# EAGLE design HackBoard (EAGLE 7.1.0)
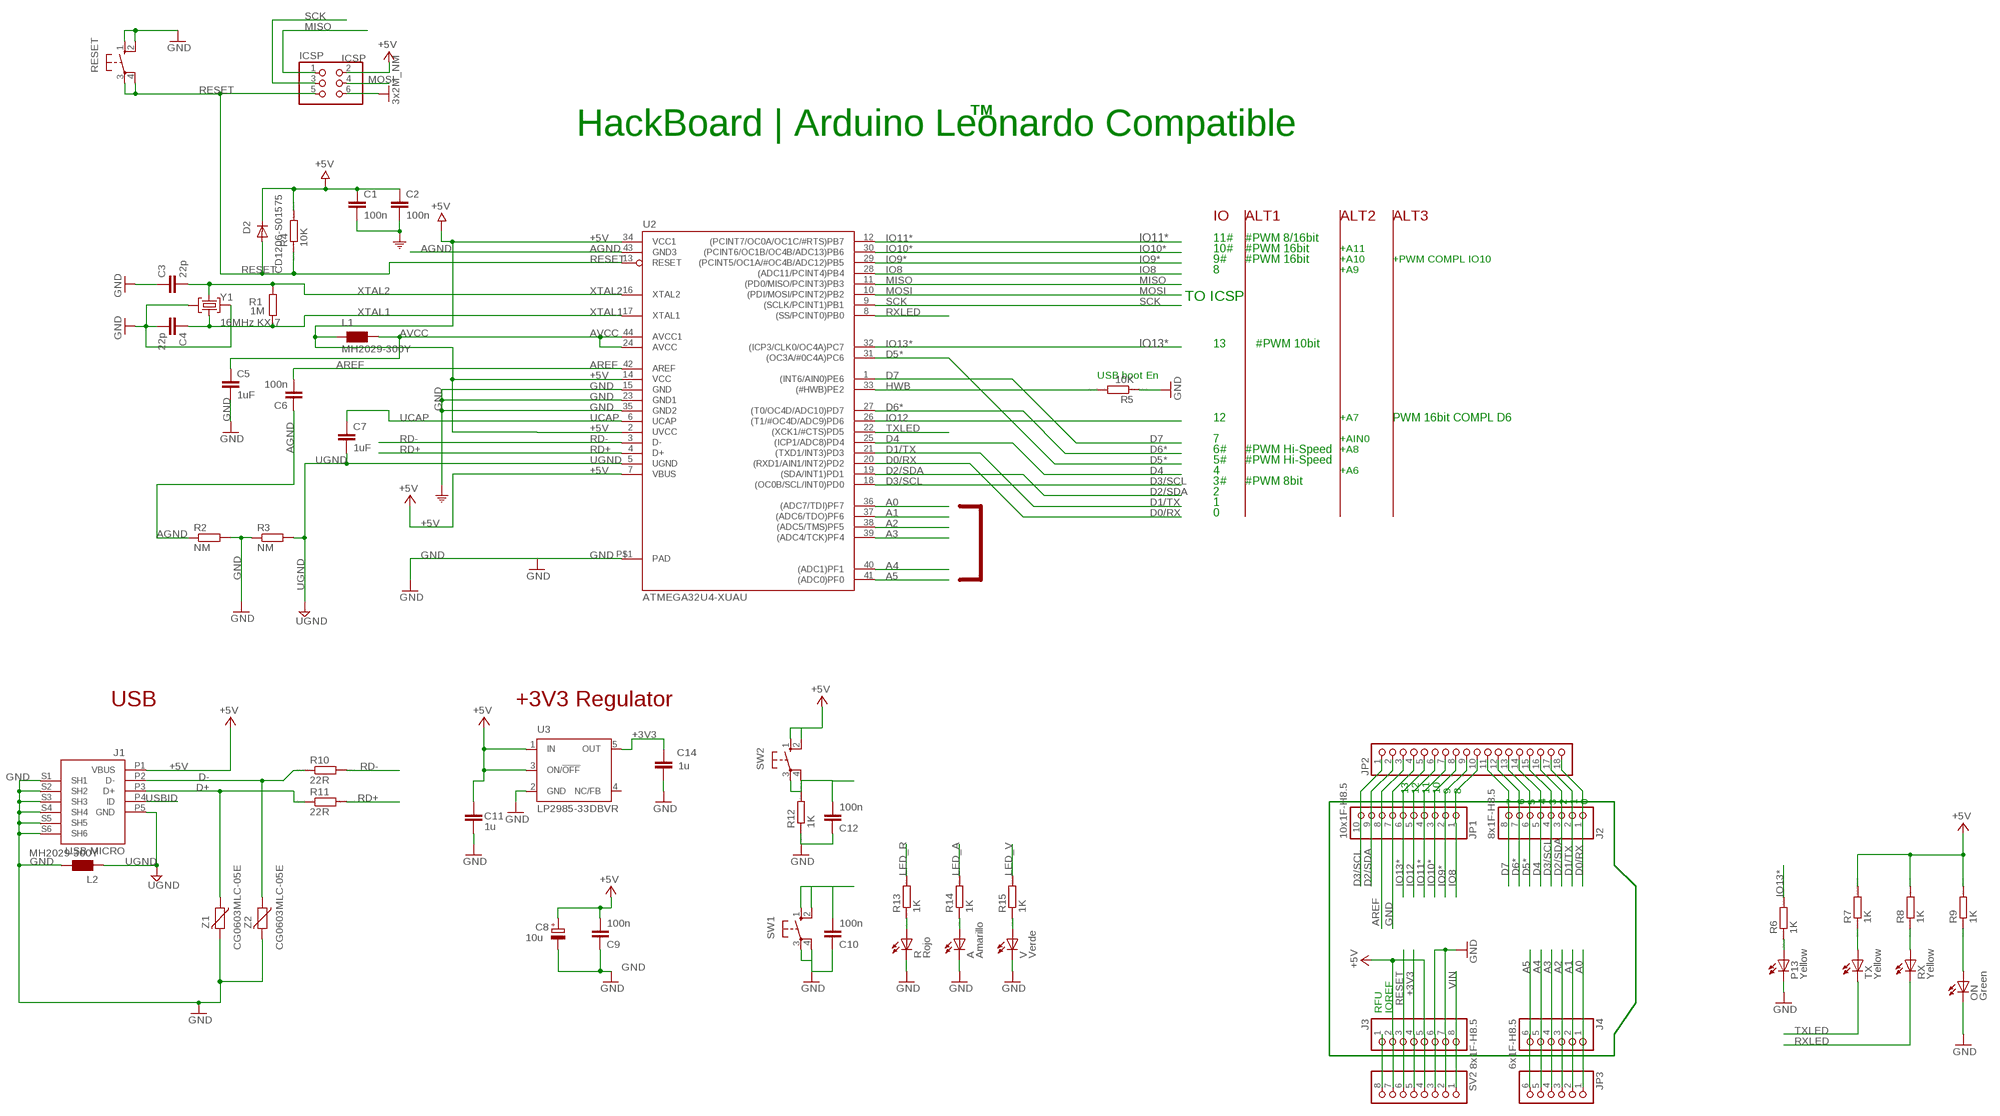
[diagram p0: schematic, sheet 1]

## Parts
A  Amarillo  LEDCHIPLED_0805  [CHIPLED_0805]
C1  100n  C-EUC0805  [C0805]
C2  100n  C-EUC0805  [C0805]
C3  22p  C-EUC0603  [C0603-ROUND]
C4  22p  C-EUC0603  [C0603-ROUND]
C5  1uF  C-EUC0603  [C0603-ROUND]
C6  100n  C-EUC0805  [C0805]
C7  1uF  C-EUC0603  [C0603-ROUND]
C8  10u  CPOL-EUSMCB  [SMC_B]
C9  100n  C-EUC0805  [C0805]
C10  100n  C-EUC0805  [C0805]
C11  1u  C-EUC0603  [C0603-ROUND]
C12  100n  C-EUC0805  [C0805]
C14  1u  C-EUC0603  [C0603-ROUND]
D2  CD1206-S01575  DIODE-MINIMELF  [MINIMELF]
ICSP  ICSP  PINHD-2X3  [2X03]
J1  USB MICRO  MYCON2_USB-MINI-B  [CON2_USB_MICRO_B_AT]
J2  8x1F-H8.5  PINHD-1X8  [1X08]
J3  8x1F-H8.5  PINHD-1X8  [1X08]
J4  6x1F-H8.5  PINHD-1X6  [1X06]
JP1  10x1F-H8.5  PINHD-1X10  [1X10]
JP2  PINHD-1X18  [1X18]
JP3  PINHD-1X6  [1X06]
L1  MH2029-300Y  WE-CBF_0805  [0805]
L2  MH2029-300Y  WE-CBF_0805  [0805]
ON  Green  LEDCHIPLED_0805  [CHIPLED_0805]
P13  Yellow  LEDCHIPLED_0805  [CHIPLED_0805]
R  Rojo  LEDCHIPLED_0805  [CHIPLED_0805]
R1  1M  R-EU_R0603  [R0603-ROUND]
R2  NM  R-EU_R0402  [R0402]
R3  NM  R-EU_R0402  [R0402]
R4  10K  R  [R0805]
R5  10K  R  [R0805]
R6  1K  R-EU_M0805  [M0805]
R7  1K  R-EU_M0805  [M0805]
R8  1K  R-EU_M0805  [M0805]
R9  1K  R-EU_M0805  [M0805]
R10  22R  R-EU_M0805  [M0805]
R11  22R  R-EU_M0805  [M0805]
R12  1K  R-EU_M0805  [M0805]
R13  1K  R-EU_M0805  [M0805]
R14  1K  R-EU_M0805  [M0805]
R15  1K  R-EU_M0805  [M0805]
RESET  10-XX  [B3F-10XX]
RX  Yellow  LEDCHIPLED_0805  [CHIPLED_0805]
SV2  PINHD-1X8  [1X08]
SW1  10-XX  [B3F-10XX]
SW2  10-XX  [B3F-10XX]
TX  Yellow  LEDCHIPLED_0805  [CHIPLED_0805]
U2  ATMEGA32U4-XUAU  [TQFP44-PAD]
U3  LP2985-33DBVR  LP2985-XXDBVR33  [SOT23-DBV]
V  Verde  LEDCHIPLED_0805  [CHIPLED_0805]
Y1  16MHz KX-7  CRYSTAL-3.2-2.5  [CRYSTAL-3.2-2.5]
Z1  CG0603MLC-05E  VARISTORCN0603  [CT/CN0603]
Z2  CG0603MLC-05E  VARISTORCN0603  [CT/CN0603]

## Nets
+3V3: C14.2 J3.4 SV2.5 U3.5(OUT)
+5V [usbvcc]: C1.1 C2.1 C8.+ C9.2 C11.2 D2.C ICSP.2 J1.P1(VBUS) J3.2 J3.5 L1.1 R4.2 R7.2 R8.2 R9.2 SV2.4 SV2.7 SW2.1(S) SW2.2(S1) U2.2(UVCC) U2.7(VBUS) U2.14(VCC) U2.34(VCC1) U3.1(IN) U3.3(ON/!OFF)
A0: J4.1 JP3.1 U2.36((ADC7/TDI)PF7)
A1: J4.2 JP3.2 U2.37((ADC6/TDO)PF6)
A2: J4.3 JP3.3 U2.38((ADC5/TMS)PF5)
A3: J4.4 JP3.4 U2.39((ADC4/TCK)PF4)
A4: J4.5 JP3.5 U2.40((ADC1)PF1)
A5: J4.6 JP3.6 U2.41((ADC0)PF0)
AGND: C6.1 R2.1 U2.43(GND3)
AREF [aref]: C6.2 JP1.8 JP2.3 U2.42(AREF)
AVCC: C5.1 L1.2 U2.24(AVCC) U2.44(AVCC1)
D0/RX: J2.1 JP2.18 U2.20((RXD1/AIN1/INT2)PD2)
D1/TX: J2.2 JP2.17 U2.21((TXD1/INT3)PD3)
D2/SDA: J2.3 JP1.9 JP2.2 JP2.16 U2.19((SDA/INT1)PD1)
D3/SCL: J2.4 JP1.10 JP2.1 JP2.15 U2.18((OC0B/SCL/INT0)PD0)
D4: J2.5 JP2.14 U2.25((ICP1/ADC8)PD4)
D5*: J2.6 JP2.13 U2.31((OC3A/#0C4A)PC6)
D6*: J2.7 JP2.12 U2.27((T0/OC4D/ADC10)PD7)
D7: J2.8 JP2.11 U2.1((INT6/AIN0)PE6)
D+: J1.P3(D+) R11.1 Z1.1
D-: J1.P2(D-) R10.1 Z2.1
GND [gnd]: A.C C1.2 C2.2 C3.1 C4.2 C5.2 C8.- C9.1 C10.1 C11.1 C12.1 C14.1 ICSP.6 J1.S1(SH1) J1.S2(SH2) J1.S3(SH3) J1.S4(SH4) J1.S5(SH5) J1.S6(SH6) J3.6 J3.7 JP1.7 JP2.4 L2.2 ON.C P13.C R2.2 R3.1 R5.1 R12.1 R.C RESET.1(S) RESET.2(S1) SV2.2 SV2.3 SW1.3(P) SW1.4(P1) U2.15(GND) U2.23(GND1) U2.35(GND2) U2.P$1(PAD) U3.2(GND) V.C Y1.2(GND) Y1.4(GND) Z1.2 Z2.2 ; supply symbol labelled 3x2M_NM, COM
HWB: R5.2 U2.33((#HWB)PE2)
IO8: JP1.1 JP2.10 U2.28((ADC11/PCINT4)PB4)
IO9*: JP1.2 JP2.9 U2.29((PCINT5/OC1A/#OC4B/ADC12)PB5)
IO10*: JP1.3 JP2.8 U2.30((PCINT6/OC1B/OC4B/ADC13)PB6)
IO11*: JP1.4 JP2.7 U2.12((PCINT7/OC0A/OC1C/#RTS)PB7)
IO12: JP1.5 JP2.6 U2.26((T1/#OC4D/ADC9)PD6)
IO13*: JP1.6 JP2.5 R6.2 U2.32((ICP3/CLK0/OC4A)PC7)
LED_A: R14.2
LED_R: R13.2
LED_V: R15.2
MISO: ICSP.1 U2.11((PD0/MISO/PCINT3)PB3)
MOSI: ICSP.4 U2.10((PDI/MOSI/PCINT2)PB2)
N$1: R7.1 TX.A
N$2: P13.A R6.1
N$3: ON.A R9.1
N$4: R8.1 RX.A
N$6: J3.1 SV2.8
N$8: R13.1 R.A
N$9: A.A R14.1
N$10: R15.1 V.A
RD+: R11.2 U2.4(D+)
RD-: R10.2 U2.3(D-)
RESET: D2.A ICSP.5 J3.3 R4.1 RESET.3(P) RESET.4(P1) SV2.6 U2.13(RESET)
RXLED: RX.C U2.8((SS/PCINT0)PB0)
SCK: ICSP.3 U2.9((SCLK/PCINT1)PB1)
SW1: C10.2 SW1.1(S) SW1.2(S1)
SW2: C12.2 R12.2 SW2.3(P) SW2.4(P1)
TXLED: TX.C U2.22((XCK1/#CTS)PD5)
UCAP: C7.1 U2.6(UCAP)
UGND [gnd]: C7.2 J1.P5(GND) L2.1 R3.2 U2.5(UGND)
USBID: J1.P4(ID)
VIN [power]: J3.8 SV2.1
XTAL1: C4.1 R1.1 U2.17(XTAL1) Y1.1(C1)
XTAL2: C3.2 R1.2 U2.16(XTAL2) Y1.3(C2)
Unconnected: U3.4(NC/FB)

## Notes on the sheet
- TM
- HackBoard | Arduino Leonardo Compatible
- IO | ALT1 | ALT2 | ALT3
- 11# | #PWM 8/16bit
- 10# | #PWM 16bit | +A11
- 9# | #PWM 16bit | +A10 | +PWM COMPL IO10
- 8 | +A9
- TO ICSP
- 13 | #PWM 10bit
- USB boot En
- 12 | +A7 | PWM 16bit COMPL D6
- 7 | +AIN0
- 6# | #PWM Hi-Speed | +A8
- 5# | #PWM Hi-Speed
- 4 | +A6
- 3# | #PWM 8bit
- 2
- 1
- 0
- USB | +3V3 Regulator
- 13 | 12 | 11 | 10 | 9 | 8
- 7 | 6 | 5 | 4 | 3 | 2 | 1 | 0
- RFU | IOREF

## Library data of the parts
A ON P13 R RX TX V = led:LED: LED OSRAM: - CHIPLED LG R971, LG N971, LY N971, LG Q971, LY Q971, LO R971, LY R971 LH N974, LH R974 LS Q976, LO Q976, LY Q976 LO Q996 - Hyper CHIPLED LW Q18S LB Q993, LB Q99A, LB R99A - SideLED LS A670, LO A670, LY A670, LG A670, LP A670 LB A673, LV A673, LT A673, LW A673 LH A674 LY A675 LS A676, LA A676, LO A676, LY A676, LW A676 LS A679, LY A679, LG A679 - Hyper Micro SIDELED® LS Y876, LA Y876, LO Y876, LY Y876 LT Y87S - SmartLED LW L88C, LW L88S LB L89C, LB L89S, LG L890 LS L89K, LO L89K, LY L89K LS L896, LA L896, LO L896, LY L896 - TOPLED LS T670, LO T670, LY T670, LG T670, LP T670 LSG T670, LSP T670, LSY T670, LOP T670, LYG T670 LG T671, LOG T671, LSG T671 LB T673, LV T673, LT T673, LW T673 LH T674 LS T676, LA T676, LO T676, LY T676, LB T676, LH T676, LSB T676, LW T676 LB T67C, LV T67C, LT T67C, LS T67K, LO T67K, LY T67K, LW E67C LS E67B, LA E67B, LO E67B, LY E67B, LB E67C, LV E67C, LT E67C LW T67C LS T679, LY T679, LG T679 LS T770, LO T770, LY T770, LG T770, LP T770 LB T773, LV T773, LT T773, LW T773 LH T774 LS E675, LA E675, LY E675, LS T675 LS T776, LA T776, LO T776, LY T776, LB T776 LHGB T686 LT T68C, LB T68C - Hyper Mini TOPLED® LB M676 - Mini TOPLED Santana® LG M470 LS M47K, LO M47K, LY M47K Source: http://www.osram.convergy.de LUXEON: - LUMILED® LXK2-PW12-R00, LXK2-PW12-S00, LXK2-PW14-U00, LXK2-PW14-V00 LXK2-PM12-R00, LXK2-PM12-S00, LXK2-PM14-U00 LXK2-PE12-Q00, LXK2-PE12-R00, LXK2-PE12-S00, LXK2-PE14-T00, LXK2-PE14-U00 LXK2-PB12-K00, LXK2-PB12-L00, LXK2-PB12-M00, LXK2-PB14-N00, LXK2-PB14-P00, LXK2-PB14-Q00 LXK2-PR12-L00, LXK2-PR12-M00, LXK2-PR14-Q00, LXK2-PR14-R00 LXK2-PD12-Q00, LXK2-PD12-R00, LXK2-PD12-S00 LXK2-PH12-R00, LXK2-PH12-S00 LXK2-PL12-P00, LXK2-PL12-Q00, LXK2-PL12-R00 Source: www.luxeon.com KINGBRIGHT: KA-3528ASYC Source: www.kingbright.com
C1 C2 C6 C9 C10 C12 = rcl:C-EU: CAPACITOR, European symbol
C3-C5 C7 C11 C14 = SmartPrj:C-EU: CAPACITOR, European symbol
C8 = rcl:CPOL-EU: POLARIZED CAPACITOR, European symbol
D2 = diode:DIODE-: DIODE
ICSP = SmartPrj:PINHD-2X3: PIN HEADER
J1 = SmartPrj:MYCON2_USB-MINI-B
J2 J3 = SmartPrj:PINHD-1X8: PIN HEADER
J4 = SmartPrj:PINHD-1X6: PIN HEADER
JP1 = SmartPrj:PINHD-1X10: PIN HEADER
JP2 = pinhead:PINHD-1X18: PIN HEADER
JP3 = pinhead:PINHD-1X6: PIN HEADER
L1 L2 = wuerth-elektronik:WE-CBF: SMD EMI Suppression Ferrite Beads - excellent anti-EMI properties - low DCR - impedances till 3000 ohms - rated current up to 6 A
R1-R3 = SmartPrj:R-EU_: RESISTOR, European symbol
R4 R5 = eagle-ltspice:R: RESISTOR, European symbol; SPICEMODEL: NONE; SPICEPREFIX: R
R6-R15 = resistor:R-EU_: RESISTOR, European symbol; SPICEPREFIX: R
RESET SW1 SW2 = switch-omron:10-XX: OMRON SWITCH; MPN: B3F-1000; OC_FARNELL: 176432; OC_NEWARK: 36M3542
SV2 = pinhead:PINHD-1X8: PIN HEADER
U2 = SmartPrj:ATMEGA32U4-XU
U3 = SmartPrj:LP2985-XXDBVR: ULTRALOW-POWER 50-mA LOW-DROPOUT LINEAR REGULATORS 50-mA Low-Dropout Regulator Source: http://focus.ti.com/lit/ds/symlink/tps77001.pdf
Y1 = SmartPrj:CRYSTAL-3.2-2.5
Z1 Z2 = varistor:VARISTOR: VARISTOR

## Net classes
0 default: width 0.254 mm, drill 0.61 mm, clearance 0.254 mm
1 power: width 0.254 mm, drill 0.61 mm, clearance 0.254 mm
2 gnd: width 0.254 mm, drill 0.61 mm, clearance 0.254 mm
3 usbvcc: width 0.254 mm, drill 0.61 mm, clearance 0.254 mm
4 aref: width 0.254 mm, drill 0.61 mm, clearance 0.254 mm

## Board
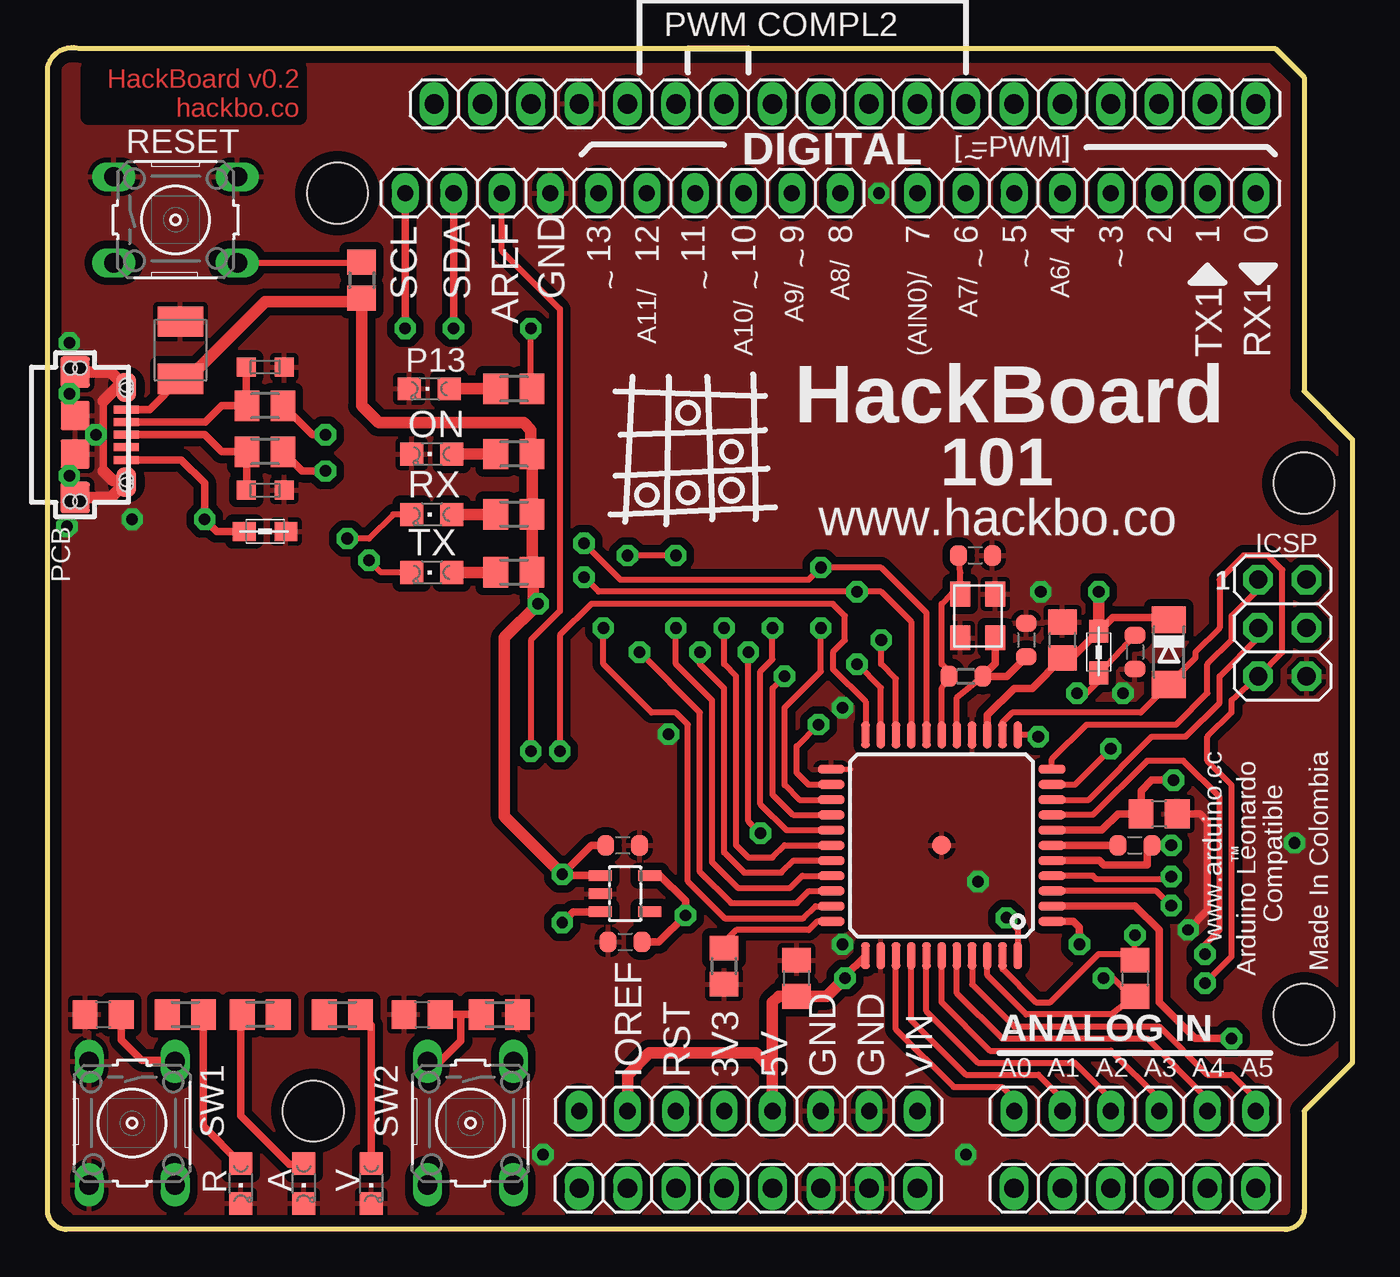
[diagram p1: board, top side]
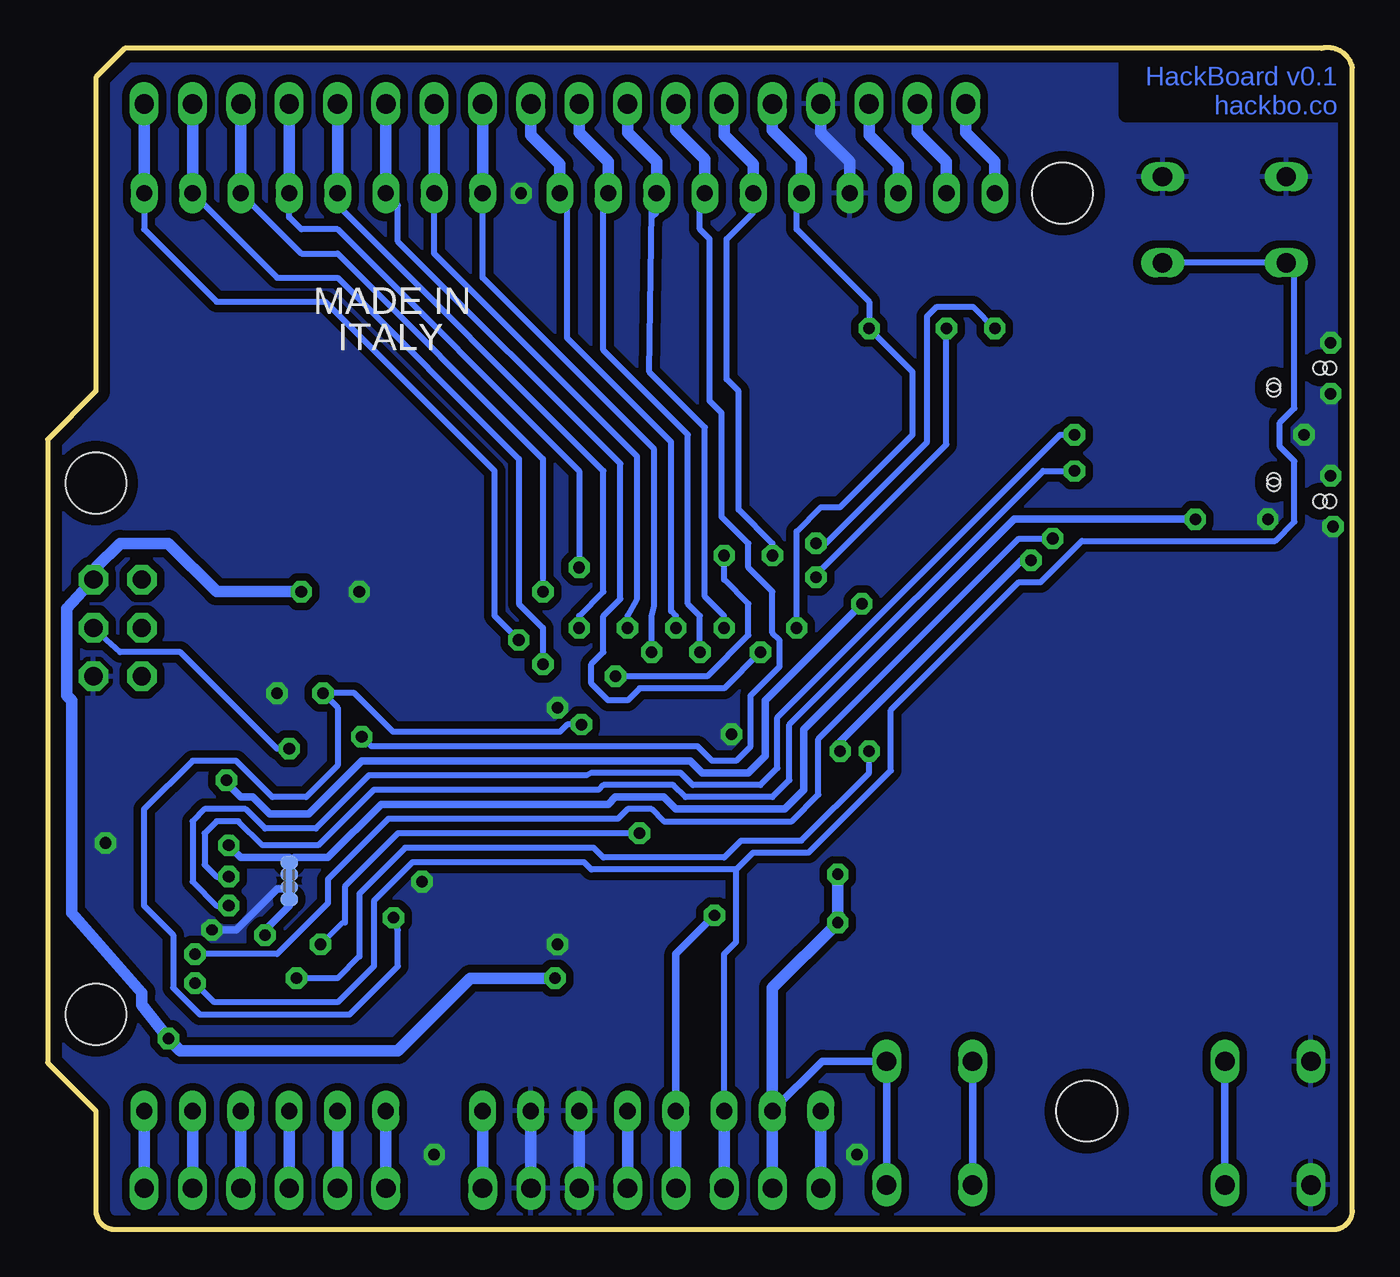
[diagram p2: board, bottom side, seen from below]

Size 68.58 x 62.14 mm. Coordinates in mm from the lower left corner, seen from the top.
Outline: 64.52,62.1 66.04,60.58 66.04,44.07 68.58,41.53 68.58,8.76 66.04,6.22 66.04,1 arc-90 65.04,0 1,0 arc-90 0,1 0,61.1 arc-90 1.64,62.1 64.52,62.1
Copper layers (1*16): Top 0.035mm / dielectric 1.5mm / Bottom 0.035mm
Design rules "default": minimum track width 10mil, minimum drill 22mil, track to track 10mil, track to pad 10mil, pad to pad 8mil, via to via 12mil, smd to smd 8mil, copper to edge 24mil, drill to drill 12mil, minimum pad ring 10mil, minimum via ring 10mil, stop-mask expansion 2mil, vias tented up to drill 30mil, thermal gap 10mil
Holes 3.2 mm at 66.04,39.24 66.04,11.3 15.24,54.48 13.97,6.22
vRestrict: area 42.5,42.3 to 43.1,42.5; area 35.8,38.9 to 36.4,39.4; area 44.5,38.9 to 45.2,39.4; area 41.3,38.9 to 41.8,39.4; area 47.9,14 to 48.5,14.5; area 50.4,13.8 to 50.9,14.7

### Footprints (pad centres in the part's own frame; a part is rotated, then mirrored left to right if it is on the bottom)
CHIPLED_0805 = smd 1.2 x 1.2: A 0,-1.05; C 0,1.05
C0805 = smd 1.3 x 1.5: 1 -0.95,0; 2 0.95,0
C0603-ROUND = smd 0.898 x 1.1: 1 -0.889,0; 2 0.889,0
SMC_B = smd 1.6 x 2.4: + -1.5,0; - 1.5,0
MINIMELF = smd 1.4 x 1.8: A 1.7,0; C -1.7,0
2X03 = drill 0.95 pad 1.55 octagon: 1 -2.54,-1.27; 2 -2.54,1.27; 3 0,-1.27; 4 0,1.27; 5 2.54,-1.27; 6 2.54,1.27
CON2_USB_MICRO_B_AT = smd 0.406 x 1.346: P1 -1.321,2.692; P2 -0.66,2.692; P3 0,2.692; P4 0.66,2.692; P5 1.321,2.692 | smd 1.651 x 1.549: S1 -3.302,0; S2 3.302,0 | smd 1.524 x 1.016: S3 -2.489,2.692; S4 2.489,2.692 | smd 1.524 x 1.524: S5 -1.016,0; S6 1.016,0 | hole 0.7: -3.505,0.254; -3.505,-0.254; 3.505,0.254; 3.505,-0.254; -2.616,2.692; -2.362,2.692; 2.362,2.692; 2.616,2.692
1X08 = drill 0.85 pad 1.422 long: 1 -8.89,0; 2 -6.35,0; 3 -3.81,0; 4 -1.27,0; 5 1.27,0; 6 3.81,0; 7 6.35,0; 8 8.89,0
1X06 = drill 0.85 pad 1.422 long: 1 -6.35,0; 2 -3.81,0; 3 -1.27,0; 4 1.27,0; 5 3.81,0; 6 6.35,0
1X10 = drill 0.85 pad 1.422 long: 1 -11.43,0; 2 -8.89,0; 3 -6.35,0; 4 -3.81,0; 5 -1.27,0; 6 1.27,0; 7 3.81,0; 8 6.35,0; 9 8.89,0; 10 11.43,0
1X18 = drill 1.016 long: 1 -21.59,0; 2 -19.05,0; 3 -16.51,0; 4 -13.97,0; 5 -11.43,0; 6 -8.89,0; 7 -6.35,0; 8 -3.81,0; 9 -1.27,0; 10 1.27,0; 11 3.81,0; 12 6.35,0; 13 8.89,0; 14 11.43,0; 15 13.97,0; 16 16.51,0; 17 19.05,0; 18 21.59,0
1X06' = drill 1.016 long: 1 -6.35,0; 2 -3.81,0; 3 -1.27,0; 4 1.27,0; 5 3.81,0; 6 6.35,0
0805 = smd 1.2 x 1: 1 -1.1,0; 2 1.1,0
R0603-ROUND = smd 0.898 x 1.1: 1 -0.889,0; 2 0.889,0
R0402 = smd 0.7 x 0.9: 1 -0.65,0; 2 0.65,0
R0805 = smd 1.3 x 1.5: 1 -0.95,0; 2 0.95,0
M0805 = smd 1.3 x 1.6: 1 -0.95,0; 2 0.95,0
B3F-10XX = drill 1.016 long: 1 -3.251,2.261; 2 3.251,2.261; 3 -3.251,-2.261; 4 3.251,-2.261
1X08' = drill 1.016 long: 1 -8.89,0; 2 -6.35,0; 3 -3.81,0; 4 -1.27,0; 5 1.27,0; 6 3.81,0; 7 6.35,0; 8 8.89,0
TQFP44-PAD = smd 1.4 x 0.45: 1 -5.8,4; 2 -5.8,3.2; 3 -5.8,2.4; 4 -5.8,1.6; 5 -5.8,0.8; 6 -5.8,0; 7 -5.8,-0.8; 8 -5.8,-1.6; 9 -5.8,-2.4; 10 -5.8,-3.2; 11 -5.8,-4; 23 5.8,-4; 24 5.8,-3.2; 25 5.8,-2.4; 26 5.8,-1.6; 27 5.8,-0.8; 28 5.8,0; 29 5.8,0.8; 30 5.8,1.6; 31 5.8,2.4; 32 5.8,3.2; 33 5.8,4 | smd 0.45 x 1.4: 12 -4,-5.8; 13 -3.2,-5.8; 14 -2.4,-5.8; 15 -1.6,-5.8; 16 -0.8,-5.8; 17 0,-5.8; 18 0.8,-5.8; 19 1.6,-5.8; 20 2.4,-5.8; 21 3.2,-5.8; 22 4,-5.8; 34 4,5.8; 35 3.2,5.8; 36 2.4,5.8; 37 1.6,5.8; 38 0.8,5.8; 39 0,5.8; 40 -0.8,5.8; 41 -1.6,5.8; 42 -2.4,5.8; 43 -3.2,5.8; 44 -4,5.8 | smd 1 x 1: P$1 0,0
SOT23-DBV = smd 0.55 x 1.2: 1 -0.95,-1.3; 2 0,-1.3; 3 0.95,-1.3; 4 0.95,1.3; 5 -0.95,1.3
CRYSTAL-3.2-2.5 = smd 1.3 x 1.05: 1 -1.15,-0.925; 2 1.15,-0.925; 3 1.15,0.925; 4 -1.15,0.925
CT/CN0603 = smd 1 x 1: 1 -1,0; 2 1,0

### Placement (x,y rotation side)
A  13.46,2.41 180 top
C1  39.37,13.21 90 top
C2  53.34,30.99 90 top
C3  51.44,30.99 270 top
C4  48.77,35.43 0 top
C5  57.15,30.35 270 top
C6  57.15,13.21 270 top
C7  57.15,20.19 0 top
C8  6.99,46.23 90 top
C9  58.42,21.84 180 top
C10  2.92,11.3 0 top
C11  30.23,20.19 180 top
C12  19.68,11.3 0 top
C14  30.35,15.11 0 top
D2  58.93,30.35 270 top
ICSP  64.9,31.62 270 top
J1  1.45,41.78 270 top
J2  54.61,54.48 180 top
J3  36.83,6.22 0 top
J4  57.15,6.22 0 top
JP1  30.23,54.48 180 top
JP2  41.91,59.18 0 top
JP3  [1X06']  57.15,2.16 0 top
L1  55.24,30.35 270 top
L2  11.43,36.7 0 top
ON  20.19,40.77 90 top
P13  20.07,44.2 90 top
R  10.16,2.41 180 top
R1  48.26,29.08 0 top
R2  55.88,18.01 90 bottom
R3  55.88,18.64 90 bottom
R4  16.51,49.91 270 top
R5  35.56,13.84 90 top
R6  24.51,44.2 0 top
R7  24.51,34.54 0 top
R8  24.51,37.59 0 top
R9  24.51,40.77 0 top
R10  11.43,43.31 0 top
R11  11.43,40.89 0 top
R12  23.75,11.3 180 top
R13  7.24,11.3 180 top
R14  11.18,11.3 0 top
R15  15.49,11.3 180 top
RESET  6.73,53.09 0 top
RX  20.19,37.59 90 top
SV2  [1X08']  36.83,2.16 180 top
SW1  4.45,5.59 270 top
SW2  22.23,5.59 270 top
TX  20.19,34.54 90 top
U2  46.99,20.19 180 top
U3  30.35,17.65 270 top
V  17.02,2.41 180 top
Y1  48.9,32.26 270 top
Z1  11.43,38.86 0 top
Z2  11.43,45.34 0 top

### Tracks (layer width: path | path; a pad name or v marks a point on that pad's centre or on a via)
+3V3  (via drill 0.6)
  Top 0.406: U3.5 31.72,18.67 32.13,18.67 33.53,17.27 v33.53,16.51 32.13,15.11 C14.2
  Bottom 0.406: J3.4 35.56,14.48 v33.53,16.51
  Bottom 0.61: J3.4 SV2.5
+5V  (via drill 0.6, 0.61)
  Top 0.305: 52.77,17.02 U2.2
  Top 0.406: U2.14 49.39,27.04 50.8,28.45 51.75,28.45 C2.1 | 53.49,29.7 C2.1 | v62.23,10.03 60.33,10.03 58.42,11.94 58.42,15.75 57.15,17.02 52.77,17.02 | 42.99,14.29 U2.34 41.91,13.31 v41.91,13.21 | D2.C 58.8,32.13 58.75,32.18 55.97,32.18 L1.1 53.83,30.04 C2.1 | U2.7 55.41,20.99 56.26,21.84 C9.2 57.47,23.05 58.04,23.62 v59.18,23.62 | J1.P1 5.36,43.1 C8.+ | U3.3 27.62,16.7 v27.05,16.13 | 27.12,18.6 U3.1 | C11.2 28.57,20.19 v27.05,18.67
  Top 0.61: v55.24,33.53 L1.1 | v41.91,13.21 40.96,12.26 C1.1 38.42,12.26 38.1,11.94 38.1,8.38 | C8.+ 7.39,44.73 11.43,48.77 16.32,48.77 R4.2 16.51,43.31 17.4,42.42 25.02,42.42 25.4,42.04 25.4,40.83 R9.2 R8.2 R7.2 25.46,34.1 25.53,34.04 25.53,33.15 v25.78,32.89 24,31.11 24,21.72 v27.05,18.67 27.12,18.6 | J3.2 30.48,8.13 31.62,9.27 37.21,9.27 38.1,8.38 | 38.1,8.38 J3.5
  Bottom 0.406: v59.18,23.62 59.18,23.5 58.42,22.73 57.78,22.73 56.9,21.84 54.86,21.84 52.07,24.64 34.8,24.64 34.16,24 31.75,24 30.86,24.89 30.86,27.81 v25.78,32.89 | SW2.2 SW2.1 27.86,8.84 J3.2
  Bottom 0.61: v55.24,33.53 59.69,33.53 62.23,36.07 64.77,36.07 66.04,34.8 ICSP.2 67.56,32.64 67.56,28.07 67.31,27.81 67.31,16.64 63.63,12.45 63.63,11.81 v62.23,10.03 61.59,9.4 50.16,9.4 46.35,13.21 v41.91,13.21 | v27.05,18.67 v27.05,16.13 30.48,12.7 J3.2 SV2.7 | SV2.4 J3.5
A0
  Top 0.305: U2.36 44.59,10.53 47.62,7.49 50.16,7.49 50.8,6.86 J4.1
  Bottom 0.61: JP3.1 J4.1
A1
  Top 0.305: U2.37 45.39,11 48.26,8.13 52.07,8.13 53.34,6.86 J4.2
  Bottom 0.61: JP3.2 J4.2
A2
  Top 0.305: U2.38 46.19,11.47 48.9,8.76 53.98,8.76 55.88,6.86 J4.3
  Bottom 0.61: JP3.3 J4.3
A3
  Top 0.305: U2.39 46.99,11.94 49.53,9.4 55.88,9.4 58.42,6.86 J4.4
  Bottom 0.61: JP3.4 J4.4
A4
  Top 0.305: U2.40 47.79,12.41 50.16,10.03 57.78,10.03 60.96,6.86 J4.5
  Bottom 0.61: JP3.5 J4.5
A5
  Top 0.305: U2.41 48.59,12.88 50.8,10.67 58.42,10.67 60.96,8.13 62.23,8.13 63.5,6.86 J4.6
  Bottom 0.61: JP3.6 J4.6
AGND  (via drill 0.61)
  Top 0.305: U2.43 50.19,13.69 51.94,11.94 52.7,11.94 55.24,14.48 56.52,14.48 57.13,13.84 C6.1 v57.15,15.47
  Bottom 0.406: v57.15,15.47 57.15,15.75 55.88,17.02 R2.1
AREF  (via drill 0.61)
  Top 0.305: U2.42 49.39,13.35 51.44,11.3 55.9,11.3 C6.2 56.96,12.26 56.01,13.21 v55.5,13.21 | v25.4,25.15 25.4,30.99 26.92,32.51 26.92,48.39 23.88,51.44 JP1.8
  Bottom 0.305: v55.5,13.21 53.34,13.21 52.2,14.35 52.2,17.65 49.78,20.07 39.88,20.07 39.37,19.56 33.02,19.56 32.13,20.45 28.96,20.45 25.4,24 v25.4,25.15
  Bottom 0.61: JP1.8 23.88,56.01 25.4,57.53 JP2.3
AVCC  (via drill 0.61)
  Top 0.305: U2.44 50.99,15.79 v50.39,16.38 | U2.24 39.98,23.39 39.37,24 39.37,25.4 v40.51,26.54 | v54.1,28.19 54.61,28.19 55.24,28.83 L1.2 55.7,29.7 C5.1
  Bottom 0.305: v50.39,16.38 50.16,15.75 50.16,13.84 52.7,11.3 60.58,11.3 61.98,12.7 61.98,15.49 63.5,17.02 63.5,22.1 60.96,24.64 58.67,24.64 56.77,22.73 54.99,22.73 53.34,24.38 53.34,27.43 v54.1,28.19 52.45,28.19 50.42,26.16 41.66,26.16 41.27,26.54 v40.51,26.54
D0/RX  (via drill 0.61)
  Top 0.305: U2.20 44.59,28.94 43.81,29.72 v43.81,30.99
  Bottom 0.305: v43.81,30.99 45.09,32.26 45.09,39.88 53.98,48.77 59.69,48.77 63.5,52.58 J2.1
  Bottom 0.61: JP2.18 J2.1
D1/TX  (via drill 0.61)
  Top 0.305: U2.21 43.79,28.47 v42.55,29.72
  Bottom 0.305: J2.2 56.52,50.04 53.34,50.04 43.81,40.51 43.81,32.89 42.55,31.62 v42.55,29.72
  Bottom 0.61: J2.2 JP2.17
D2/SDA  (via drill 0.61)
  Top 0.305: U2.19 45.39,31.95 43.81,33.53 v42.55,33.53 28.96,33.53 v28.19,34.29
  Top 0.406: v21.34,47.37 JP1.9
  Bottom 0.305: J2.3 55.24,51.31 53.34,51.31 42.55,40.51 v42.55,33.53 | v28.19,34.29 28.19,34.42 21.34,41.27 v21.34,47.37
  Bottom 0.61: J2.3 JP2.16 | JP1.9 21.34,56.13 22.86,57.66 JP2.2
D3/SCL  (via drill 0.61)
  Top 0.305: v28.19,36.07 30.1,34.16 40.01,34.16 v40.64,34.8 43.81,34.8 46.19,32.42 U2.18
  Top 0.406: v18.8,47.37 JP1.10
  Bottom 0.305: J2.4 55.88,53.21 55.24,52.58 53.34,52.58 40.64,39.88 v40.64,34.8 | v28.19,36.07 27.69,36.07 22.35,41.4 22.35,48.01 21.84,48.51 19.94,48.51 v18.8,47.37
  Bottom 0.61: J2.4 JP2.15 | JP1.10 18.8,56.13 20.32,57.66 JP2.1
D4  (via drill 0.61)
  Top 0.305: U2.25 39.51,22.59 38.73,23.37 38.73,27.43 40.64,29.34 v40.64,31.62
  Bottom 0.305: J2.5 53.34,53.85 39.37,39.88 39.37,33.53 40.64,32.26 v40.64,31.62
  Bottom 0.61: J2.5 JP2.14
D5*  (via drill 0.61)
  Top 0.305: U2.31 40.02,17.79 39.38,17.16 35.93,17.16 34.29,18.8 34.29,27.18 v31.11,30.35
  Bottom 0.305: J2.6 50.16,53.85 50.16,51.94 38.48,40.26 38.48,33.15 39.37,32.26 39.37,30.35 40.01,29.72 40.01,28.7 39.12,27.81 38.1,27.81 37.47,28.45 33.02,28.45 v31.11,30.35
  Bottom 0.61: J2.6 JP2.13
D6*  (via drill 0.61)
  Top 0.305: U2.27 38.82,20.99 37.47,22.35 37.47,29.34 38.1,29.97 v38.1,31.62
  Bottom 0.305: J2.7 48.26,51.31 37.59,40.64 37.59,33.15 38.1,32.26 v38.1,31.62
  Bottom 0.61: J2.7 JP2.12
D7  (via drill 0.61)
  Top 0.305: v37.47,20.83 36.83,21.46 v36.83,30.35
  Top 0.406: U2.1 53.91,16.19 54.23,15.88 v54.23,14.99
  Bottom 0.254: 52.96,16.13 53.09,16.13 v54.23,14.99
  Bottom 0.305: J2.8 45.72,50.04 36.7,41.02 36.7,32.77 36.83,32.26 v36.83,30.35 | v37.47,20.83 50.16,20.83 52.96,18.03 52.96,16.13
  Bottom 0.61: J2.8 JP2.11
D+
  Top 0.406: J1.P3 8.26,41.78 9.14,40.89 R11.1 10.48,38.66 Z1.1
D-
  Top 0.406: J1.P2 8.28,42.44 9.14,43.31 R10.1 10.43,43.74 Z2.1
GND  (via drill 0.6, 0.61, 0.61 pad 1.02)
  Top 0.254: 42.22,24.19 U2.23
  Top 0.305: J1.S4 4.06,39.37
  Top 0.406: 2.92,39.88 2.92,43.56 | v59.94,15.75 60.96,16.76 60.96,21.46 60.58,21.84 C9.1
  Top 0.61: J1.S1 3.33,45.09 J1.S3 3.63,44.27 2.92,43.56 | J1.S2 3.33,38.48 J1.S4 | 2.92,39.88 3.43,39.37 4.06,39.37
  Bottom 0.406: R2.2 R3.1 55.97,17.91 56.52,17.91 58.67,15.75 v59.94,15.75
  Bottom 0.61: JP1.7 26.42,56.13 27.94,57.66 JP2.4 | SV2.3 J3.6 | SV2.2 J3.7
  other vias: 41.78,14.99 48.9,18.29 41.78,27.43 56.52,28.19 65.53,20.32 48.26,3.94 43.69,54.48 32.64,26.04 4.45,37.34 26.04,3.94 1.14,43.94 1.14,39.62 2.54,41.78 1.14,46.61 1.02,36.96 52.2,33.53
  pour Bottom (isolate 0.406, rank 2): 0.64,61.47 69.22,61.47 69.22,0.64 1.64,0.64 arc-90 0.64,5.32
  pour Top (isolate 0.406, rank 2): 0.64,61.47 71.25,61.47 71.12,5.32 arc-90 70.12,0.64 1.64,0.64 arc-90 0.64,5.32
HWB
  Top 0.305: U2.33 40.45,16.19 40.01,15.75 36.2,15.75 35.56,15.11 R5.2
IO8  (via drill 0.61)
  Top 0.305: U2.28 38.73,20.19 38.1,19.56 36.83,19.56 36.2,20.19 36.2,29.08 35.56,29.72 v35.56,31.62
  Bottom 0.305: v35.56,31.62 35.56,32.26 35.81,32.51 35.81,41.4 41.27,46.86 41.27,54.1 JP1.1
  Bottom 0.61: JP1.1 41.66,56.01 43.18,57.53 JP2.10
IO9*  (via drill 0.61)
  Top 0.305: U2.29 39.2,19.39 38.57,18.76 36.61,18.76 35.56,19.81 35.56,28.45 34.29,29.72 v34.29,30.35
  Bottom 0.305: v34.29,30.35 34.29,32.26 34.92,32.89 34.92,41.78 39.37,46.23 39.37,54.23 JP1.2
  Bottom 0.61: JP1.2 39.12,56.13 40.64,57.66 JP2.9
IO10*  (via drill 0.61)
  Top 0.305: U2.30 39.67,18.59 39.04,17.96 36.27,17.96 34.92,19.3 34.92,27.81 33.02,29.72 v33.02,31.62
  Bottom 0.305: 36.58,53.85 36.58,53.47 36.83,53.21 | 36.58,53.85 JP1.3 | v33.02,31.62 33.02,32.26 34.04,33.27 34.04,42.16 36.96,45.09 36.83,53.59 36.58,53.85
  Bottom 0.61: JP1.3 36.58,56.13 38.1,57.66 JP2.8
IO11*  (via drill 0.61)
  Top 0.305: U2.12 52.16,25.99 v52.07,25.91
  Bottom 0.305: v52.07,25.91 51.56,25.4 34.42,25.4 33.66,24.64 32.38,24.64 31.62,25.4 31.62,28.07 30.1,29.59 30.1,30.99 30.48,31.37 30.48,33.53 31.75,34.8 31.75,36.07 33.15,37.47 33.15,42.93 33.78,43.56 33.78,52.07 34.29,52.58 34.29,54.23 JP1.4
  Bottom 0.61: JP1.4 34.04,56.26 35.56,57.78 JP2.7
IO12  (via drill 0.61)
  Top 0.305: U2.26 39.17,21.79 38.1,22.86 38.1,28.45 v38.73,29.08 | v33.02,35.43 v30.48,35.43
  Bottom 0.305: v38.73,29.08 33.91,29.08 31.75,31.24 31.75,32.89 33.02,34.16 v33.02,35.43 | JP1.5 31.5,53.47 32.89,52.07 32.89,44.7 32.26,44.07 32.26,37.85 30.48,36.07 v30.48,35.43
  Bottom 0.61: JP1.5 31.5,56.01 33.02,57.53 JP2.6
IO13*  (via drill 0.6, 0.61)
  Top 0.305: U2.32 40.36,16.99 39.73,16.36 35.59,16.36 33.66,18.29 33.66,26.54 33.02,27.18 31.75,27.18 29.21,29.72 v29.21,31.62 | R6.2 25.4,44.26 v25.4,47.37
  Bottom 0.305: JP1.6 29.21,54.23 29.21,52.58 25.4,48.77 v25.4,47.37 23.11,45.09 23.11,41.78 26.92,37.97 27.94,37.97 29.21,36.7 v29.21,31.62
  Bottom 0.61: JP1.6 28.96,56.26 30.48,57.78 JP2.5
MISO
  Top 0.305: U2.11 52.79,24.72 54.61,26.54 59.31,26.54 60.96,28.19 60.96,29.72 62.23,30.99 62.23,32.26 63.63,33.66 ICSP.1
MOSI  (via drill 0.61)
  Top 0.305: U2.10 54,23.39 v55.88,25.27
  Bottom 0.305: v55.88,25.27 56.52,25.27 61.59,30.35 64.77,30.35 ICSP.4
N$1
  Top 0.61: R7.1 TX.A
N$2
  Top 0.61: P13.A R6.1
N$3
  Top 0.61: R9.1 ON.A
N$4
  Top 0.61: R8.1 RX.A
N$6
  Bottom 0.61: J3.1 SV2.8
N$8
  Top 0.406: R13.1 8.19,5.43 R.A
N$9
  Top 0.406: A.A 13.37,3.43 12.7,3.43 10.16,5.97 10.16,11.24 R14.1 10.41,11.24
N$10
  Top 0.406: R15.1 17.02,10.73 V.A
RD+  (via drill 0.61)
  Top 0.305: 58.98,18.47 v59.05,18.54 58.93,18.41 55.12,18.41 54.94,18.59 U2.4
  Top 0.406: R11.2 13.4,39.88 v14.61,39.88
  Bottom 0.305: v14.61,39.88 16.26,39.88 29.59,26.54 29.59,23.62 30.48,22.73 35.05,22.73 35.69,23.37 39.37,23.37 39.62,23.11 51.44,23.11 54.36,20.19 57.28,20.19 58.55,21.46 59.69,21.46 60.33,20.83 60.33,19.18 59.69,18.54 v59.05,18.54
RD-  (via drill 0.61)
  Top 0.305: v59.05,17.02 58.28,17.79 U2.3
  Top 0.406: R10.2 13.9,41.78 v14.61,41.78
  Bottom 0.305: v14.61,41.78 15.37,41.78 30.23,26.92 30.23,24.26 31.11,23.37 34.67,23.37 35.31,24 40.01,24 40.26,23.88 51.69,23.88 54.48,21.08 57.15,21.08 58.17,22.1 60.33,22.1 60.96,21.46 60.96,18.29 59.69,17.02 v59.05,17.02
RESET  (via drill 0.61)
  Top 0.305: v60.83,12.95 62.23,14.35 62.23,23.37 60.96,24.64 60.96,25.91 62.23,27.18 62.23,27.81 ICSP.5 64.9,30.35 64.9,34.67 64.14,35.43 62.87,35.43 61.59,34.16 61.59,31.62 60.33,30.35 60.33,30.05 D2.A 57.45,27.18 50.7,27.18 50.19,26.67 U2.13 | RESET.4 16.47,50.83 R4.1
  Bottom 0.305: 32.38,18.92 31.5,19.81 28.57,19.81 24.26,24.13 24.26,27.3 17.53,34.04 16.38,34.04 14.22,36.2 4.06,36.2 3.05,37.21 3.05,40.39 3.81,41.15 3.81,42.42 3.05,43.18 3.05,50.39 RESET.3 RESET.4 | 32.38,18.92 40.01,18.92 40.39,19.3 49.4,19.3 51.44,17.27 51.44,13.84 53.34,11.94 59.82,11.94 v60.83,12.95 | J3.3 33.02,14.48 32.38,15.11 32.38,18.92
  Bottom 0.61: J3.3 SV2.6
RXLED  (via drill 0.61)
  Top 0.305: U2.8 54.94,21.79 57.78,24.64 59.69,24.64 61.59,22.73 61.59,15.75 60.83,14.99 v60.83,14.48 | v15.75,36.32 16.89,36.32 18.16,37.59 RX.C
  Bottom 0.305: v60.83,14.48 56.52,14.48 53.85,17.14 53.85,18.41 50.67,21.59 38.61,21.59 38.1,22.1 36.83,22.1 36.2,21.46 29.46,21.46 28.07,22.86 28.07,25.78 17.53,36.32 v15.75,36.32
SCK
  Top 0.305: U2.9 54.72,22.59 58.04,25.91 59.82,25.91 61.59,27.69 61.59,29.08 63.63,31.11 ICSP.3
SW1
  Top 0.406: C10.2 3.87,9.97 4.95,8.89 6.66,8.89 SW1.1
  Bottom 0.406: SW1.1 SW1.2
SW2
  Top 0.406: SW2.3 20.65,8.84 21.72,9.91 21.72,11.3 | 21.72,11.3 C12.2 | R12.2 21.72,11.3
  Bottom 0.406: SW2.4 SW2.3
TXLED  (via drill 0.61)
  Top 0.305: U2.22 42.99,27.75 41.27,29.46 41.27,30.35 41.91,30.99 41.91,32.26 41.27,32.89 28.57,32.89 26.92,31.24 v26.92,25.15 | TX.C 17.53,34.54 v16.89,35.18
  Bottom 0.305: 17.4,35.18 v16.89,35.18
  Bottom 0.406: 17.4,35.18 26.92,25.65 v26.92,25.15
UCAP
  Top 0.406: U2.6 C7.1
UGND  (via drill 0.61)
  Top 0.406: v59.05,20.19 C7.2 57.78,20.18 57.78,19.18 55.5,19.18 55.28,19.39 U2.5 | J1.P5 7.04,40.46 8.26,39.24 v8.26,37.34 8.89,36.7 L2.1
  Bottom 0.406: v59.05,20.19 58.42,19.56 55.88,19.56 R3.2 55.62,19.56 53.85,19.56 51.05,22.35 39.12,22.35 38.73,22.73 36.2,22.73 35.56,22.1 29.84,22.1 28.83,23.11 28.83,26.29 17.78,37.34 v8.26,37.34
VIN
  Bottom 0.61: J3.8 SV2.1
XTAL1
  Top 0.305: U2.17 46.99,28.43 R1.1 47.62,29.08 46.99,29.72 46.99,32.89 47.51,33.41 Y1.1 47.97,34.52 C4.1
XTAL2
  Top 0.305: U2.16 47.79,27.96 R1.2 | 49.55,30.83 Y1.3 49.82,31.24
  Top 0.406: C3.2 50.42,29.08 R1.2 49.82,29.75 Y1.3

### Text on the board
Top: HackBoard v0.2 / hackbo.co
Bottom: HackBoard v0.1 / hackbo.co
tPlace: PWM COMPL1 | PWM COMPL2 | 13 | 12 | 11 | 10 | 9 | 8 | 7 | 6 | 5 | 4 | 3 | 2 | 1 | 0
tNames: DIGITAL | [ =PWM] | ~ | ~ | ~ | ~ | ~ | SCL | SDA | GND | ~ | ~ | ~ | A8/ | A6/ | AREF | A9/ | A7/ | A11/ | A10/ | (AIN0)/ | TX1 | RX1 | HackBoard | 101 | www.hackbo.co | 1 | TM | Compatible | www.arduino.cc | Made In Colombia | Arduino Leonardo | ANALOG IN | IOREF | RST | 3V3 | 5V | GND | GND | VIN | A0 | A1 | A2 | A3 | A4 | A5
bNames: MADE IN | ITALY
ReferenceLC: X2